# Altium schematic sheet FT2232D.SchDoc: FT2232D
size A; Revision: 04
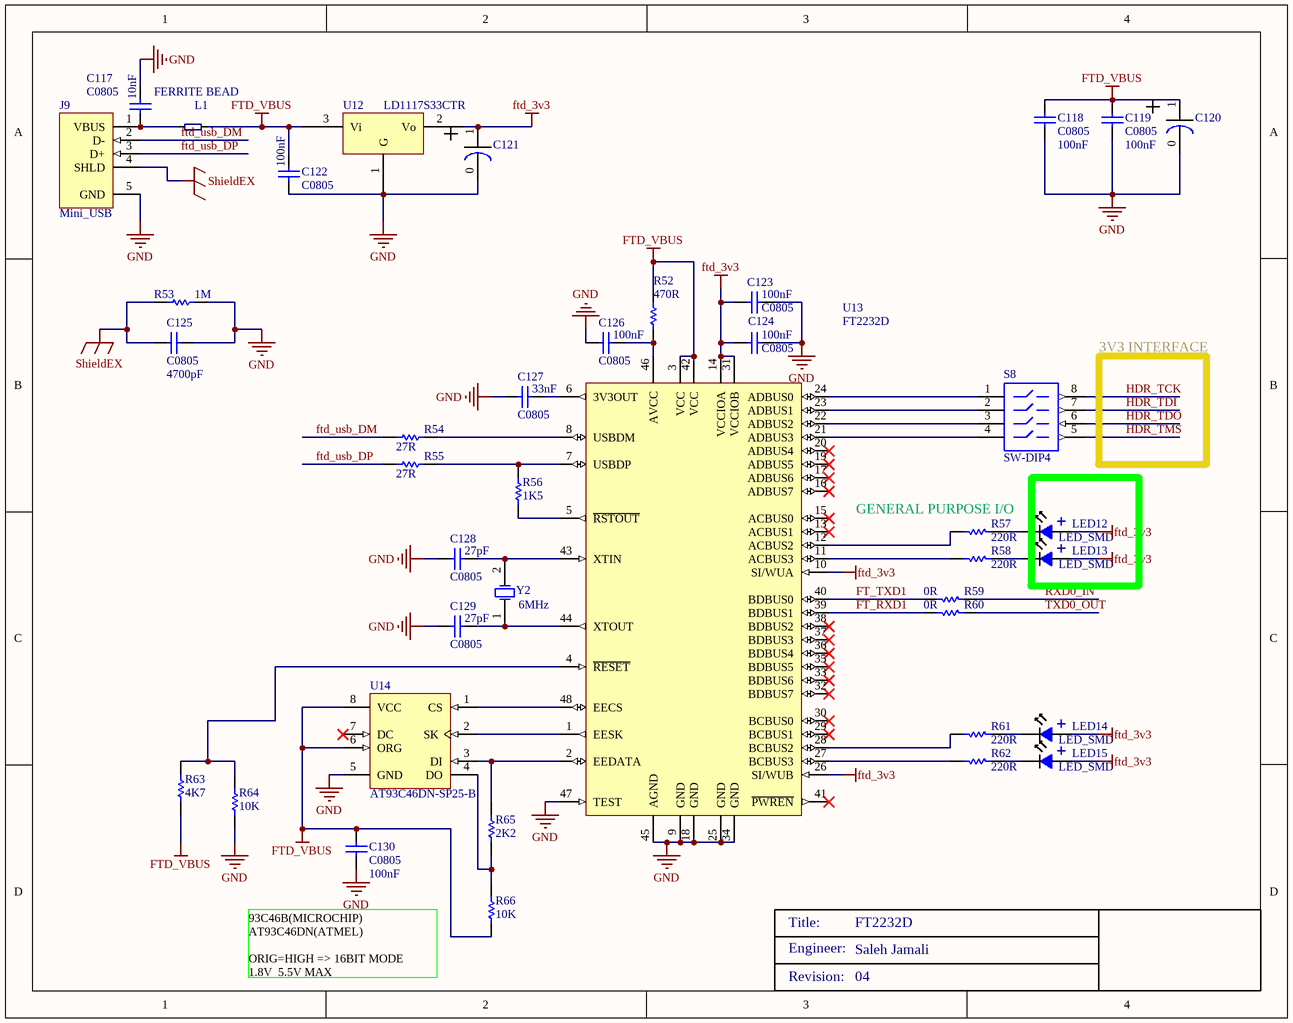
[diagram p0: FT2232D.SchDoc]

## Parts
C117  C0805  value 10nF  [0805]
C118  C0805  value 100nF  [0805]
C119  C0805  value 100nF  [0805]
C120  Electrolytic SMD Cap  [22_47u_10A]  (value not drawn)
C121  Electrolytic SMD Cap  [22_47u_10A]  (value not drawn)
C122  C0805  value 100nF  [0805]
C123  C0805  value 100nF  [0805]
C124  C0805  value 100nF  [0805]
C125  C0805  value 4700pF  [0805]
C126  C0805  value 100nF  [0805]
C127  C0805  value 33nF  [0805]
C128  C0805  value 27pF  [0805]
C129  C0805  value 27pF  [0805]
C130  C0805  value 100nF  [0805]
J9  Mini_USB  [My_USB]
L1  FERRITE BEAD  [smd_ferrite_1206]
LED12  LED_SMD  [LED_805]
LED13  LED_SMD  [LED_805]
LED14  LED_SMD  [LED_805]
LED15  LED_SMD  [LED_805]
R52  470R  [ERA-0805]
R53  1M  [ERA-0805]
R54  27R  [ERA-0805]
R55  27R  [ERA-0805]
R56  1K5  [ERA-0805]
R57  220R  [ERA-0805]
R58  220R  [ERA-0805]
R59  0R  [ERA-0805]
R60  0R  [ERA-0805]
R61  220R  [ERA-0805]
R62  220R  [ERA-0805]
R63  4K7  [ERA-0805]
R64  10K  [ERA-0805]
R65  2K2  [ERA-0805]
R66  10K  [ERA-0805]
S8  SW-DIP4  [DIP-8]
U12  LD1117S33CTR  [SOT223]
U13  FT2232D  [LQFP-48_M]
U14  AT93C46DN-SP25-B  [8S1_M]
Y2  6MHz  [HC-49U]

## Nets
ftd_3v3: C121.1 C123.1 C124.1 LED12.1 LED13.1 LED14.1 LED15.1 U12.2(Vo) U13.10(SI/WUA) U13.14(VCCIOA) U13.26(SI/WUB) U13.31(VCCIOB)
FTD_VBUS: C118.2 C119.2 C120.1 C122.1 C130.2 L1.1 R52.1 R63.1 R66.1 U12.3(Vi) U13.3(VCC) U13.42(VCC) U14.6(ORG) U14.8(VCC)
GND: C117.1 C118.1 C119.1 C120.0 C121.0 C122.2 C123.2 C124.2 C125.2 C126.1 C127.1 C128.1 C129.1 C130.1 J9.5(GND) R53.1 R64.1 U12.1(G) U13.9(GND) U13.18(GND) U13.25(GND) U13.34(GND) U13.45(AGND) U13.47(TEST) U14.5(GND)
ShieldEX: C125.1 J9.4(SHLD) R53.2
FT_RXD1: R60.2 U13.39(BDBUS1)
FT_TXD1: R59.2 U13.40(BDBUS0)
ftd_usb_DM: J9.2(D-) R54.2
ftd_usb_DP: J9.3(D+) R55.2
HDR_TCK: S8.8
HDR_TDI: S8.7
HDR_TDO: S8.6
HDR_TMS: S8.5
RXD0_IN: R59.1
TXD0_OUT: R60.1
NetC117_2: C117.2 J9.1(VBUS) L1.0
NetC126_2: C126.2 R52.2 U13.46(AVCC)
NetC127_2: C127.2 U13.6(3V3OUT)
NetC128_2: C128.2 U13.43(XTIN) Y2.2(OSC2)
NetC129_2: C129.2 U13.44(XTOUT) Y2.1(OSC1)
NetLED12_2: LED12.2 R57.1
NetLED13_2: LED13.2 R58.1
NetLED14_2: LED14.2 R61.1
NetLED15_2: LED15.2 R62.1
NetR54_1: R54.1 U13.8(USBDM)
NetR55_1: R55.1 R56.2 U13.7(USBDP)
NetR56_1: R56.1 U13.5(~{RSTOUT})
NetR57_2: R57.2 U13.12(ACBUS2)
NetR58_2: R58.2 U13.11(ACBUS3)
NetR61_2: R61.2 U13.28(BCBUS2)
NetR62_2: R62.2 U13.27(BCBUS3)
NetR63_2: R63.2 R64.2 U13.4(~{RESET})
NetR65_1: R65.1 R66.2 U14.4(DO)
NetR65_2: R65.2 U13.2(EEDATA) U14.3(DI)
NetS8_1: S8.1 U13.24(ADBUS0)
NetS8_2: S8.2 U13.23(ADBUS1)
NetS8_3: S8.3 U13.22(ADBUS2)
NetS8_4: S8.4 U13.21(ADBUS3)
NetU13_1: U13.1(EESK) U14.2(SK)
NetU13_48: U13.48(EECS) U14.1(CS)

Not connected (* = marked no-connect by the designer): U13 13(ACBUS1)* 15(ACBUS0)* 16(ADBUS7)* 17(ADBUS6)* 19(ADBUS5)* 20(ADBUS4)* 29(BCBUS1)* 30(BCBUS0)* 32(BDBUS7)* 33(BDBUS6)* 35(BDBUS5)* 36(BDBUS4)* 37(BDBUS3)* 38(BDBUS2)* 41(~{PWREN})*; U14 7(DC)*

## Notes on the sheet
- 3V3 INTERFACE
- (near R57) GENERAL PURPOSE I/O
- 93C46B(MICROCHIP)
  AT93C46DN(ATMEL)
  ORIG=HIGH => 16BIT MODE
  1.8V  5.5V MAX
- Engineer:
- Title:
- Saleh Jamali
- Revision:

## Library data of the parts
C117-C119 C122-C130 = C0805: Ceramic Chip Capacitor - Standard; Note: Footprint corresponds to dimensions for bulk cassette packaging. This case size has tightened tolerances.; Published: 17-Jul-2002; LatestRevisionDate: 19-Mar-2004; LatestRevisionNote: Silkscreen size reduced.; DatasheetDocument: Mar-2001; PackageDocument: Mar-2001; PackageReference: 0805; Publisher: Altium Limited; Code_JEITA: 0805; Code_IPC: 2012[0805]; ComponentLink1Description: Manufacturer Link; ComponentLink1URL: http://www.kemet.com/; ComponentLink2Description: Datasheet; ComponentLink2URL: http://www.kemet.com/kemet/web/homepage/kechome.nsf/vapubfilesname/F3102TA.pdf/$file/F3102TA.pdf
J9 = Mini_USB: USB 2.0, Right Angle, SMT, B Type, Receptacle, 5 Position, Black; ContactMaterial: Copper Alloy; ContactPlating: Gold (30); PCB_Layout: Complies with manufacturer's recommendation.; DrillSize: Corresponds to nominal value.; PanelGround: Without; Published: 15-Jul-2004; DatasheetDocument: 27-Jun-2003; PackageDocument: 27-Jun-2003; PackageReference: 440247; Publisher: Altium Limited; HousingMaterial: Thermoplastic; ComponentLink1Description: Manufacturer Link; ComponentLink1URL: http://www.tycoelectronics.com/; ComponentLink2Description: Packaging Specification; ComponentLink2URL: http://ecommas.tycoelectronics.com/commerce/DocumentDelivery/DDEController?Action=showdoc&DocId=Customer+Drawing%7F440247%7FD%7Fpdf%7FEnglish%7FC_440247_D.pdf
L1 = FERRITE BEAD: SIZE:
R52-R66 = ERA6Y: Rectangular Thick Film Chip Resistor, 10 Ohm to 1M Ohm Range, 0.1% and 0.5% Tolerance, 0805 Size, 0.1 W; Note: If flow soldering, adjust pad width of PCB Footprint to 0.7 - 0.8 times the width of the resistor.; Published: 17-Dec-2003; LatestRevisionDate: 19-Mar-2004; LatestRevisionNote: Silkscreen size reduced.; PackageDocument: Mar-2003; PackageReference: ERA-0805; Publisher: Altium Limited; Code_IPC: 2012 [0805]; ComponentLink1Description: Manufacturer Link; ComponentLink1URL: http://www.panasonic.com/industrial/components/resistive_products.htm; ComponentLink2Description: Datasheet; ComponentLink2URL: http://www.panasonic.com/industrial/components/pdf/AOA0000CE8.pdf
S8 = SW-DIP4: DIP Switch; Published: 24-Mar-1999; LatestRevisionDate: 17-Jul-2002; LatestRevisionNote: Re-released for DXP Platform.; PackageReference: DIP-8; Publisher: Altium Limited
U12 = LD1117S33CTR: 2.5 volt, 800mA Regulator
U13 = FT2232D: FT2232D Dual USB to Serial UART/FIFO IC, -40 to +85 degC, 48-pin LQFP; Manufacturer: FTDI; DatasheetVersion: ver 2.05, Apr-2011; PackageVersion: Apr-11; PackageReference: LQFP-48; PackageDescription: 48-Pin Thin Quad Flat Pack, 7 x 7 mm Body, 0.5 mm Pitch; PartNumber: FT2232D; ComponentLink1Description: Manufacturer URL; ComponentLink1URL: http://www.ftdichip.com/; ComponentLink2Description: Datasheet; ComponentLink2URL: http://www.ftdichip.com/Support/Documents/DataSheets/ICs/DS_FT2232D.pdf
U14 = AT93C46DN-SP25-B: 1Kbit (128 x 8 or 64 x 16), 3-wire Bus Serial Automotive EEPROM, 2.5V, 8-Pin SOIC, Bulk; DatasheetVersion: 8674B,  Oct-2009; PackageVersion: revC, Mar-2005; PackageReference: 8S1; PackageDescription: 8-Lead (0.150" Wide Body), Plastic Gull Wing Small Outline (JEDEC SOIC); Code_JEDEC: MS-012-AA; Code_IPC: SOIC127P600-8; ComponentLink1Description: Manufacturer URL; ComponentLink1URL: http://www.atmel.com/; ComponentLink2Description: Datasheet; ComponentLink2URL: http://www.atmel.com/dyn/resources/prod_documents/doc8674.pdf
Y2 = ECS-18-13-1: Crystal Oscillator; Published: 17-Jul-2002; DatasheetDocument: 18-Apr-2000; PackageReference: HC-49U; Publisher: Altium Limited; ComponentLink1Description: Manufacturer Link; ComponentLink1URL: http://www.ecsxtal.com/; ComponentLink2Description: Datasheet; ComponentLink2URL: http://www.ecsxtal.com/pdf2/HC49U.PDF
C120 C121 = Electrolytic SMD Cap: supplier: eshop.eca.ir